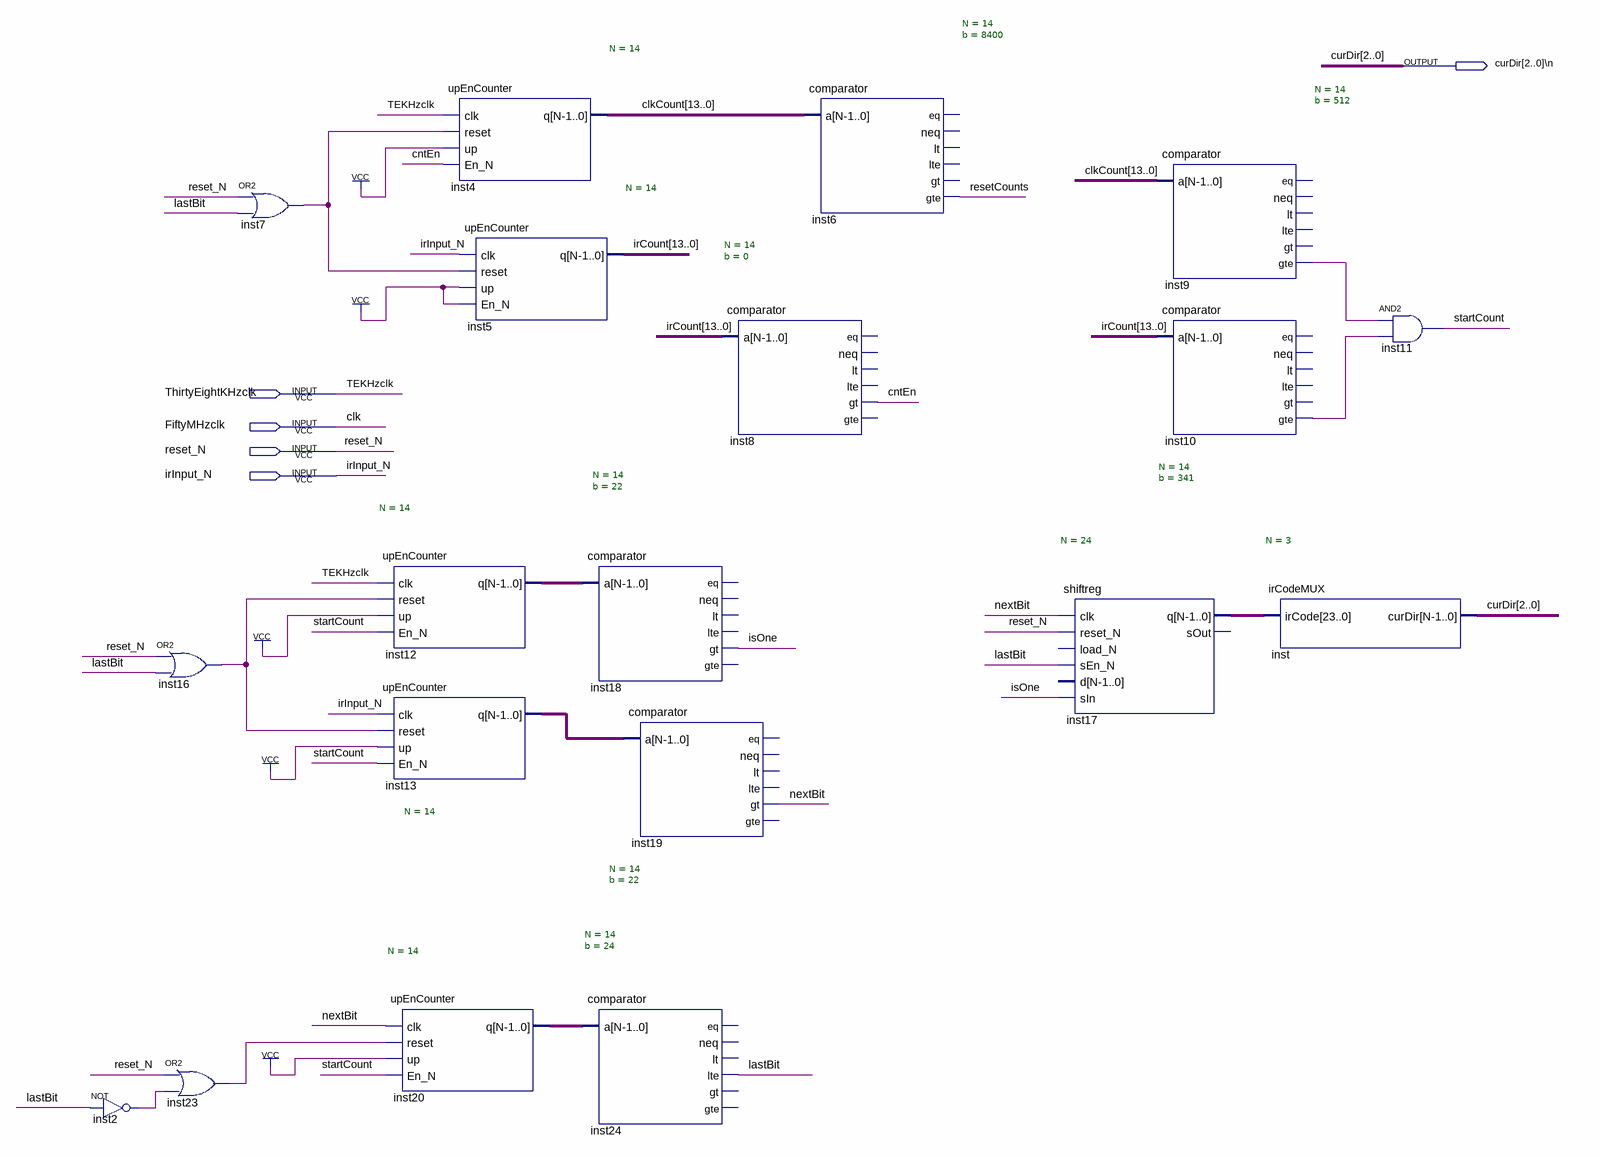
[diagram p0: schematic sheet]
// Quartus schematic irModule.bdf as structural Verilog: 19 symbols, 5 pins
module irModule (
  input  ThirtyEightKHzclk,
  input  FiftyMHzclk,
  input  reset_N,
  input  irInput_N,
  output \curDir[2..0]\n 
);

  wire cntEn, inst2_out, inst7_out, inst9_gte, inst10_gte, inst16_out, inst23_out, isOne, lastBit, nextBit,
       resetCounts, startCount;
  wire [2:0] curDir;
  wire [13:0] clkCount, inst12_q, inst13_q, inst20_q, irCount;
  wire [23:0] inst17_q;

  not inst2 (inst2_out, lastBit);
  or inst16 (inst16_out, reset_N, lastBit);
  or inst23 (inst23_out, reset_N, inst2_out);
  or inst7 (inst7_out, reset_N, lastBit);
  upEnCounter #(.N(14)) inst12 (
    .clk(ThirtyEightKHzclk), .reset(inst16_out), .up(1'b1), .En_N(startCount), .q(inst12_q));
  upEnCounter #(.N(14)) inst13 (.clk(irInput_N), .reset(inst16_out), .up(1'b1), .En_N(startCount), .q(inst13_q));
  upEnCounter #(.N(14)) inst20 (.clk(nextBit), .reset(inst23_out), .up(1'b1), .En_N(startCount), .q(inst20_q));
  upEnCounter #(.N(14)) inst4 (.clk(ThirtyEightKHzclk), .reset(inst7_out), .up(1'b1), .En_N(cntEn), .q(clkCount));
  upEnCounter #(.N(14)) inst5 (.clk(irInput_N), .reset(inst7_out), .up(1'b1), .En_N(1'b1), .q(irCount));
  comparator #(.N(14), .b(22)) inst18 (.a(inst12_q), .gt(isOne));  // open: eq, neq, lt, lte, gte
  comparator #(.N(14), .b(24)) inst24 (.a(inst20_q), .lte(lastBit));  // open: eq, neq, lt, gt, gte
  comparator #(.N(14), .b(22)) inst19 (.a(inst13_q), .gt(nextBit));  // open: eq, neq, lt, lte, gte
  comparator #(.N(14), .b(0)) inst8 (.a(irCount), .gt(cntEn));  // open: eq, neq, lt, lte, gte
  comparator #(.N(14), .b(8400)) inst6 (.a(clkCount), .gte(resetCounts));  // open: eq, neq, lt, lte, gt
  shiftreg #(.N(24)) inst17 (
    .clk(nextBit), .reset_N(reset_N), .sEn_N(lastBit), .sIn(isOne), .q(inst17_q));  // open: load_N, d, sOut
  comparator #(.N(14), .b(512)) inst9 (.a(clkCount), .gte(inst9_gte));  // open: eq, neq, lt, lte, gt
  comparator #(.N(14), .b(341)) inst10 (.a(irCount), .gte(inst10_gte));  // open: eq, neq, lt, lte, gt
  irCodeMUX #(.N(3)) inst (.irCode(inst17_q), .curDir(curDir));
  and inst11 (startCount, inst9_gte, inst10_gte);

  // Other names for the same wires on the sheet: clk = FiftyMHzclk; TEKHzclk = ThirtyEightKHzclk
endmodule
